# EAGLE schematic dlp.2-channel-mixer.v1.0 (EAGLE 6.5.0)
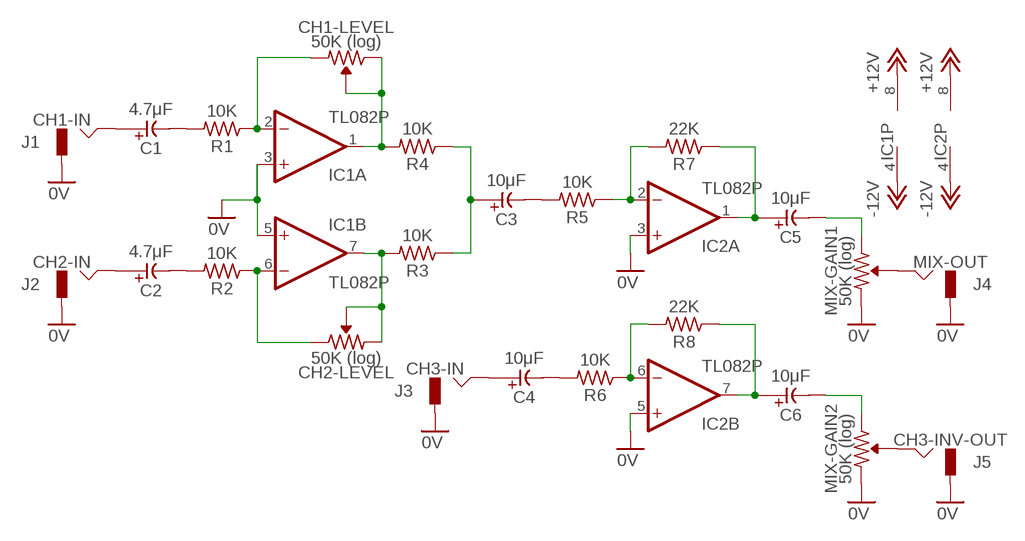
[diagram p0: schematic, sheet 1]

## Parts
C1  4.7μF  CE-USE2-5  [E2-5]
C2  4.7μF  CE-USE2-5  [E2-5]
C3  10μF  CE-USE2-5  [E2-5]
C4  10μF  CE-USE2-5  [E2-5]
C5  10μF  CE-USE2-5  [E2-5]
C6  10μF  CE-USE2-5  [E2-5]
CH1-LEVEL  50K (log)  R-VAR  [R-VAR]
CH2-LEVEL  50K (log)  R-VAR  [R-VAR]
IC1  TL082P  [DIL08]
IC2  TL082P  [DIL08]
J1  CH1-IN  JACK-M  [JACK-M]
J2  CH2-IN  JACK-M  [JACK-M]
J3  CH3-IN  JACK-M  [JACK-M]
J4  MIX-OUT  JACK-M  [JACK-M]
J5  CH3-INV-OUT  JACK-M  [JACK-M]
MIX-GAIN1  50K (log)  R-VAR  [R-VAR]
MIX-GAIN2  50K (log)  R-VAR  [R-VAR]
R1  10K  R0309/10  [0309/10]
R2  10K  R0309/10  [0309/10]
R3  10K  R0309/10  [0309/10]
R4  10K  R0309/10  [0309/10]
R5  10K  R0309/10  [0309/10]
R6  10K  R0309/10  [0309/10]
R7  22K  R0309/10  [0309/10]
R8  22K  R0309/10  [0309/10]

## Nets
0V: IC1.3(A:+IN) IC1.5(B:+IN) IC2.3(A:+IN) IC2.5(B:+IN) J1.GND J2.GND J3.GND J4.GND J5.GND MIX-GAIN1.R2 MIX-GAIN2.R2
+12V: IC1.8(P:V+) IC2.8(P:V+)
-12V: IC1.4(P:V-) IC2.4(P:V-)
N$1: C1.+ J1.HOT
N$2: C1.- R1.2
N$3: CH1-LEVEL.R2 IC1.2(A:-IN) R1.1
N$4: CH2-LEVEL.R1 IC1.6(B:-IN) R2.1
N$5: C2.- R2.2
N$6: C2.+ J2.HOT
N$7: CH2-LEVEL.R2 CH2-LEVEL.VAR IC1.7(B:OUT) R3.2
N$8: CH1-LEVEL.R1 CH1-LEVEL.VAR IC1.1(A:OUT) R4.2
N$10: C3.- R5.2
N$11: IC2.2(A:-IN) R5.1 R7.2
N$13: C5.+ IC2.1(A:OUT) R7.1
N$14: C3.+ R3.1 R4.1
N$15: IC2.6(B:-IN) R6.1 R8.2
N$16: C4.- R6.2
N$17: C4.+ J3.HOT
N$18: C6.+ IC2.7(B:OUT) R8.1
N$19: C6.- MIX-GAIN2.R1
N$20: J4.HOT MIX-GAIN1.VAR
N$21: J5.HOT MIX-GAIN2.VAR
N$22: C5.- MIX-GAIN1.R1

## Library data of the parts
C1-C6 = _common:CE-US: ELECTROLYTIC CAPACITOR, US symbol
CH1-LEVEL CH2-LEVEL MIX-GAIN1 MIX-GAIN2 = _common:R-VAR
IC1 IC2 = _common:TL082: OP AMP
J1-J5 = _common:JACK-M
R1-R8 = _common:R: RESISTOR, US symbol